# Altium schematic sheet nRF9161.SchDoc
size A3; ApprovedBy: Mustafa Atılay Beycan; CheckedBy: Mustafa Atılay Beycan; Author: Mustafa Atılay Beycan; CompanyName: Mustafa Atılay Beycan; DrawnBy: Mustafa Atılay Beycan; Engineer: Mustafa Atılay Beycan; Organization: Mustafa Atılay Beycan; SheetNumber: 3; SheetTotal: 8; FilePath: https://github.com/mustafaatilay/Outdoor-Tracking-Project
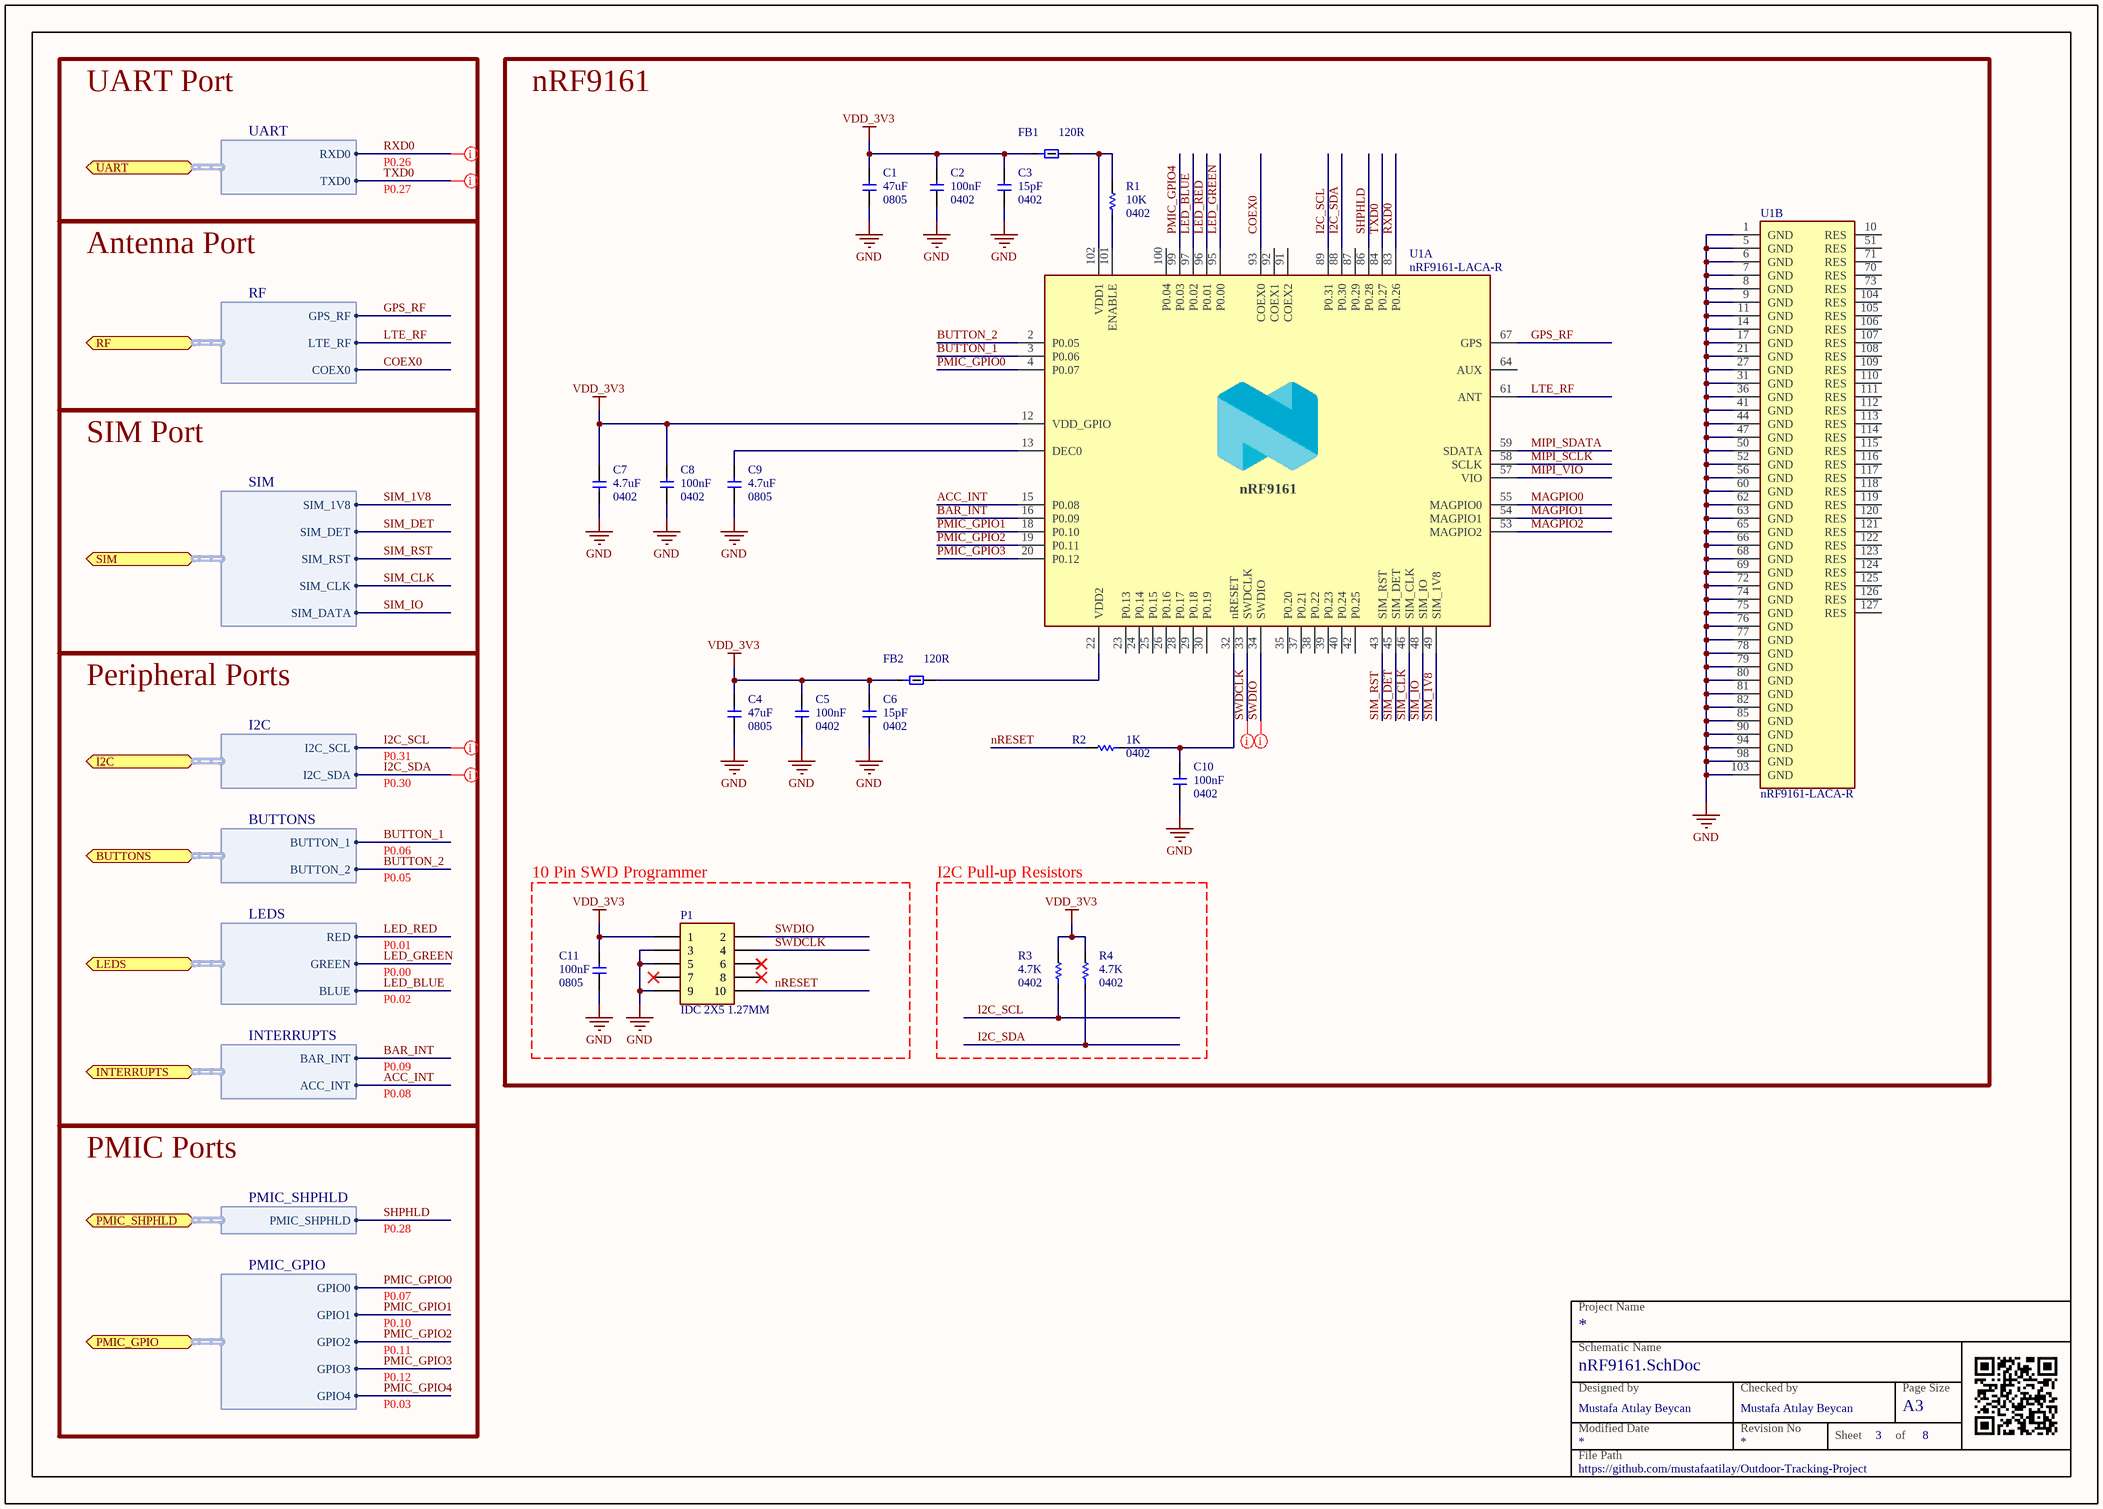
[diagram p0: nRF9161.SchDoc]

## Parts
C1  Capacitance: 47uF  Package: 0805  [CAP 0805]  (hidden comment: 47uF 10% X7R 10V 0805 SMD)
C2  Capacitance: 100nF  Package: 0402  [CAP 0402]  (hidden comment: 100nF 10% X7R 10V 0402 SMD)
C3  Capacitance: 15pF  Package: 0402  [CAP 0402]  (hidden comment: 15pF 10% X7R 16V 0402 SMD)
C4  Capacitance: 47uF  Package: 0805  [CAP 0805]  (hidden comment: 47uF 10% X7R 10V 0805 SMD)
C5  Capacitance: 100nF  Package: 0402  [CAP 0402]  (hidden comment: 100nF 10% X7R 10V 0402 SMD)
C6  Capacitance: 15pF  Package: 0402  [CAP 0402]  (hidden comment: 15pF 10% X7R 16V 0402 SMD)
C7  Capacitance: 4.7uF  Package: 0402  [CAP 0402]  (hidden comment: 4.7uF 10% X7R 10V 0402 SMD)
C8  Capacitance: 100nF  Package: 0402  [CAP 0402]  (hidden comment: 100nF 10% X7R 10V 0402 SMD)
C9  Capacitance: 4.7uF  Package: 0805  [CAP 0805]  (hidden comment: 4.7uF 10% X7R 10V 0805 SMD)
C10  Capacitance: 100nF  Package: 0402  [CAP 0402]  (hidden comment: 100nF 10% X7R 16V 0402 SMD)
C11  Capacitance: 100nF  Package: 0805  [CAP 0805]  (hidden comment: 100nF 10% X7R 16V 0805 SMD)
FB1  Impedance: 120R  [FERRITE 0402]  (hidden comment: BLM15AX121SN1D)
FB2  Impedance: 120R  [FERRITE 0402]  (hidden comment: BLM15AX121SN1D)
P1  IDC 2X5 1.27MM  [CONN 2x5 IDC 1.27MM]
R1  Resistance: 10K  Package: 0402  [RES 0402]  (hidden comment: 10K 1% 1/10W 0402 SMD)
R2  Resistance: 1K  Package: 0402  [RES 0402]  (hidden comment: 1K 5% 1/10W 0402 SMD)
R3  Resistance: 4.7K  Package: 0402  [RES 0402]  (hidden comment: 4.7K 5% 1/10W 0402 SMD)
R4  Resistance: 4.7K  Package: 0402  [RES 0402]  (hidden comment: 4.7K 5% 1/10W 0402 SMD)
U1  nRF9161-LACA-R  [IC nRF9161]  (parts A,B of 2)

## Blocks framed on the sheet
nRF9161: C1-C10 FB1 FB2 R1 R2 U1
10 Pin SWD Programmer: C11 P1
I2C Pull-up Resistors: R3 R4

## Ports
BUTTONS (bidir, harness BUTTONS), I2C (bidir, harness I2C), INTERRUPTS (bidir, harness INTERRUPTS), LEDS (bidir, harness LEDS), PMIC_GPIO (bidir, harness PMIC_GPIO), PMIC_SHPHLD (bidir, harness PMIC_SHPHLD), RF (bidir, harness RF), SIM (bidir, harness SIM), UART (bidir, harness UART)

## Harnesses
PMIC_GPIO: GPIO0, GPIO1, GPIO2, GPIO3, GPIO4
PMIC_SHPHLD: PMIC_SHPHLD
I2C: I2C_SCL, I2C_SDA
BUTTONS: BUTTON_1, BUTTON_2
LEDS: RED, GREEN, BLUE
INTERRUPTS: BAR_INT, ACC_INT
SIM: SIM_1V8, SIM_DET, SIM_RST, SIM_CLK, SIM_DATA
RF: GPS_RF, LTE_RF, COEX0
UART: RXD0, TXD0

## Nets
GND: C1.2 C2.2 C3.2 C4.2 C5.2 C6.2 C7.1 C8.2 C9.2 C10.2 C11.2 P1.3 P1.5 P1.9 U1.1(GND) U1.5(GND) U1.6(GND) U1.7(GND) U1.8(GND) U1.9(GND) U1.11(GND) U1.14(GND) U1.17(GND) U1.21(GND) U1.27(GND) U1.31(GND) U1.36(GND) U1.41(GND) U1.44(GND) U1.47(GND) U1.50(GND) U1.52(GND) U1.56(GND) U1.60(GND) U1.62(GND) U1.63(GND) U1.65(GND) U1.66(GND) U1.68(GND) U1.69(GND) U1.72(GND) U1.74(GND) U1.75(GND) U1.76(GND) U1.77(GND) U1.78(GND) U1.79(GND) U1.80(GND) U1.81(GND) U1.82(GND) U1.85(GND) U1.90(GND) U1.94(GND) U1.98(GND) U1.103(GND)
VDD_3V3: C1.1 C2.1 C3.1 C4.1 C5.1 C6.1 C7.2 C8.1 C11.1 FB1.1 FB2.1 P1.1 R3.2 R4.2 U1.12(VDD_GPIO)
ACC_INT: U1.15(P0.08) ; port INTERRUPTS.ACC_INT
BAR_INT: U1.16(P0.09) ; port INTERRUPTS.BAR_INT
BUTTON_1: U1.3(P0.06) ; port BUTTONS.BUTTON_1
BUTTON_2: U1.2(P0.05) ; port BUTTONS.BUTTON_2
COEX0: U1.93(COEX0) ; port RF.COEX0
GPS_RF: U1.67(GPS) ; port RF.GPS_RF
I2C_SCL: R3.1 U1.89(P0.31) ; port I2C.I2C_SCL
I2C_SDA: R4.1 U1.88(P0.30) ; port I2C.I2C_SDA
LED_BLUE: U1.97(P0.02) ; port LEDS.BLUE
LED_GREEN: U1.95(P0.00) ; port LEDS.GREEN
LED_RED: U1.96(P0.01) ; port LEDS.RED
LTE_RF: U1.61(ANT) ; port RF.LTE_RF
MAGPIO0: U1.55(MAGPIO0)
MAGPIO1: U1.54(MAGPIO1)
MAGPIO2: U1.53(MAGPIO2)
MIPI_SCLK: U1.58(SCLK)
MIPI_SDATA: U1.59(SDATA)
MIPI_VIO: U1.57(VIO)
nRESET: P1.10 R2.2
PMIC_GPIO0: U1.4(P0.07) ; port PMIC_GPIO.GPIO0
PMIC_GPIO1: U1.18(P0.10) ; port PMIC_GPIO.GPIO1
PMIC_GPIO2: U1.19(P0.11) ; port PMIC_GPIO.GPIO2
PMIC_GPIO3: U1.20(P0.12) ; port PMIC_GPIO.GPIO3
PMIC_GPIO4: U1.99(P0.03) ; port PMIC_GPIO.GPIO4
RXD0: U1.83(P0.26) ; port UART.RXD0
SHPHLD: U1.86(P0.28) ; port PMIC_SHPHLD.PMIC_SHPHLD
SIM_1V8: U1.49(SIM_1V8) ; port SIM.SIM_1V8
SIM_CLK: U1.46(SIM_CLK) ; port SIM.SIM_CLK
SIM_DET: U1.45(SIM_DET) ; port SIM.SIM_DET
SIM_IO: U1.48(SIM_IO) ; port SIM.SIM_DATA
SIM_RST: U1.43(SIM_RST) ; port SIM.SIM_RST
SWDCLK: P1.4 U1.33(SWDCLK)
SWDIO: P1.2 U1.34(SWDIO)
TXD0: U1.84(P0.27) ; port UART.TXD0
NetC9_1: C9.1 U1.13(DEC0)
NetC10_1: C10.1 R2.1 U1.32(nRESET)
NetFB1_2: FB1.2 R1.2 U1.102(VDD1)
NetFB2_2: FB2.2 U1.22(VDD2)
NetR1_1: R1.1 U1.101(ENABLE)

Not connected (* = marked no-connect by the designer): P1 6* 7* 8*; U1 10(RES) 23(P0.13) 24(P0.14) 25(P0.15) 26(P0.16) 28(P0.17) 29(P0.18) 30(P0.19) 35(P0.20) 37(P0.21) 38(P0.22) 39(P0.23) 40(P0.24) 42(P0.25) 51(RES) 64(AUX) 70(RES) 71(RES) 73(RES) 87(P0.29) 91(COEX2) 92(COEX1) 100(P0.04) 104(RES) 105(RES) 106(RES) 107(RES) 108(RES) 109(RES) 110(RES) 111(RES) 112(RES) 113(RES) 114(RES) 115(RES) 116(RES) 117(RES) 118(RES) 119(RES) 120(RES) 121(RES) 122(RES) 123(RES) 124(RES) 125(RES) 126(RES) 127(RES)

## Layout directives
net class SWD: SWDCLK, SWDIO
net class UART: RXD0, TXD0
net class I2C: I2C_SCL, I2C_SDA

## Notes on the sheet
- UART Port
- P0.26
- P0.27
- Antenna Port
- SIM Port
- Peripheral Ports
- P0.30
- P0.31
- P0.06
- P0.05
- P0.00
- P0.01
- P0.02
- P0.09
- P0.08
- PMIC Ports
- P0.28
- P0.07
- P0.10
- P0.03
- P0.11
- P0.12
- Project Name
- Designed by
- Schematic Name
- Checked by
- Page Size
- File Path
- Modified Date
- Revision No
- Sheet
- of
- A3
- (in symbol IC nRF9161-LACA-R, part A) nRF9161

## Library data of the parts
C1 C4 = CAP 0805 47uF 10V: ALT MALZEME KODU: 1.009.00956; Link: *; Manufacturer: *; Manufacturer Part Number: *; Value: 47uF 10% X7R 10V 0805 SMD; Tolerance: 10%; TemperatureCoefficient: X7R; Mount: SMD; Voltage: 10V
C2 C5 C8 = CAP 0402 100nF 10V: ALT MALZEME KODU: 1.009.00840; Link: *; Manufacturer: *; Manufacturer Part Number: *; Value: 100nF 10% X7R 10V 0402 SMD; Tolerance: 10%; TemperatureCoefficient: X7R; Mount: SMD; Voltage: 10V
C3 C6 = CAP 0402 15pF 16V: ALT MALZEME KODU: 1.009.00947; Link: *; Manufacturer: *; Manufacturer Part Number: *; Value: 15pF 10% X7R 16V 0402 SMD; Tolerance: 10%; TemperatureCoefficient: X7R; Mount: SMD; Voltage: 16V
C7 = CAP 0402 4.7uF 10V: ALT MALZEME KODU: 1.009.00987; Link: *; Manufacturer: *; Manufacturer Part Number: *; Value: 4.7uF 10% X7R 10V 0402 SMD; Tolerance: 10%; TemperatureCoefficient: X7R; Mount: SMD; Voltage: 10V
C9 = CAP 0805 4.7uF 10V: ALT MALZEME KODU: 1.009.00882; Link: *; Manufacturer: *; Manufacturer Part Number: *; Value: 4.7uF 10% X7R 10V 0805 SMD; Tolerance: 10%; TemperatureCoefficient: X7R; Mount: SMD; Voltage: 10V
C10 = CAP 0402 100nF 16V: ALT MALZEME KODU: 1.009.00275; Link: *; Manufacturer: *; Manufacturer Part Number: *; Value: 100nF 10% X7R 16V 0402 SMD; Tolerance: 10%; TemperatureCoefficient: X7R; Mount: SMD; Voltage: 16V
C11 = CAP 0805 100nF 16V: ALT MALZEME KODU: 1.009.00953; Link: *; Manufacturer: *; Manufacturer Part Number: *; Value: 100nF 10% X7R 16V 0805 SMD; Tolerance: 10%; TemperatureCoefficient: X7R; Mount: SMD; Voltage: 16V
FB1 FB2 = FER BLM15AX121SN1D: FERRITE BEAD 120 OHM 0402 1LN; Manufacturer: Murata; Material: Steel; Core Material: 228ConductorMaterial; Tolerance: 25%; Current Rating: 700mA; Number of Lines: 1; DC Resistance (DCR): 130mR; Test Frequency: 100MHz; ComponentLink1URL: https://datasheet.ciiva.com/18183/getdatasheetpartid-238207-18183177.pdf?src-supplier=Verical; ComponentLink1Description: https://datasheet.ciiva.com/18183/getdatasheetpartid-238207-18183177.pdf?src-supplier=Verical; ComponentLink2URL: https://datasheet.ciiva.com/41449/001172204-da-01-en-drossel-0402-600r-1-0x0-5mm-10000st-41449492.pdf?src-supplier=Conrad; ComponentLink2Description: https://datasheet.ciiva.com/41449/001172204-da-01-en-drossel-0402-600r-1-0x0-5mm-10000st-41449492.pdf?src-supplier=Conrad; ComponentLink3URL: https://datasheet.ciiva.com/41425/001171685-da-01-en-chip-drossel0402-600r-300ma-1-0x0-5mm-41425771.pdf?src-supplier=Conrad; ComponentLink3Description: https://datasheet.ciiva.com/41425/001171685-da-01-en-chip-drossel0402-600r-300ma-1-0x0-5mm-41425771.pdf?src-supplier=Conrad; ComponentLink4URL: https://datasheet.ciiva.com/1014/l0110s0101blm15h-1014466.pdf?src-supplier=Digi-Key; ComponentLink4Description: https://datasheet.ciiva.com/1014/l0110s0101blm15h-1014466.pdf?src-supplier=Digi-Key; ComponentLink5URL: https://datasheet.ciiva.com/1014/l0110s0101blm15h-1014467.pdf?src-supplier=Digi-Key; ComponentLink5Description: https://datasheet.ciiva.com/1014/l0110s0101blm15h-1014467.pdf?src-supplier=Digi-Key; ComponentLink6URL: https://datasheet.ciiva.com/1466/5168-1466917.pdf?src-supplier=Element14; ComponentLink6Description: https://datasheet.ciiva.com/1466/5168-1466917.pdf?src-supplier=Element14; ComponentLink7URL: https://datasheet.ciiva.com/1466/5168-1466918.pdf?src-supplier=Element14; ComponentLink7Description: https://datasheet.ciiva.com/1466/5168-1466918.pdf?src-supplier=Element14; ComponentLink8URL: https://datasheet.ciiva.com/3081/l0110s0101blm15h-3081608.pdf?src-supplier=Avnet; ComponentLink8Description: https://datasheet.ciiva.com/3081/l0110s0101blm15h-3081608.pdf?src-supplier=Avnet; ComponentLink9URL: https://datasheet.ciiva.com/6212/l0110s0101blm15h-6212328.pdf?src-supplier=Digi-Key; ComponentLink9Description: https://datasheet.ciiva.com/6212/l0110s0101blm15h-6212328.pdf?src-supplier=Digi-Key; ComponentLink10URL: https://datasheet.ciiva.com/16204/l0110s0101blm15h-16204027.pdf?src-supplier=Future+Electronics; ComponentLink10Description: https://datasheet.ciiva.com/16204/l0110s0101blm15h-16204027.pdf?src-supplier=Future+Electronics; Link: https://bit.ly/3wIr28H; ALT MALZEME KODU: *; Supplier 1: Mouser; Manufacturer Part Number: BLM15AX121SN1D; RoHS: Yes; Category: Ferrite Beads and Chips; Stock 1: 30042; Pricing 1: 1=0,1, 10=0,051, 50=0,051, 100=0,028, 1000=0,022, 10000=0,015 (USD); Case/Package: 0402; Number of Pins: 2; Case Code (Metric): 1005; Case Code (Imperial): 0402; Weight: 2.3E-05oz; Min Operating Temperature: -55°C; Max Operating Temperature: 125°C; Package Quantity: 1; Packaging: Tape and Reel; Max Current Rating: 700mA; Termination: SMD/SMT; Max DC Current: 700mA; Number of Circuits: 1; Series: BLM15AX_SN; RMS Current (Irms): 700mA; Series Resistance: 130mR; Length: 1mm; Width: 0.5mm; Height: 0.5mm; Reach SVHC Compliant: No; Lead Free: Lead Free; RoHS Compliant: Yes; ComponentLink11URL: https://datasheet.ciiva.com/41449/001172167-da-01-en-drossel-0402-120r-1-0x0-5mm-10000st-41449456.pdf?src-supplier=Conrad; ComponentLink11Description: https://datasheet.ciiva.com/41449/001172167-da-01-en-drossel-0402-120r-1-0x0-5mm-10000st-41449456.pdf?src-supplier=Conrad; ComponentLink12URL: https://datasheet.ciiva.com/1012/l0110e-1012387.pdf?src-supplier=Digikey; ComponentLink12Description: https://datasheet.ciiva.com/1012/l0110e-1012387.pdf?src-supplier=Digikey; ComponentLink13URL: https://datasheet.ciiva.com/1012/l0110e-1012386.pdf?src-supplier=Digikey; ComponentLink13Description: https://datasheet.ciiva.com/1012/l0110e-1012386.pdf?src-supplier=Digikey; ComponentLink14URL: https://datasheet.ciiva.com/1012/l0110e-1012388.pdf?src-supplier=Digikey; ComponentLink14Description: https://datasheet.ciiva.com/1012/l0110e-1012388.pdf?src-supplier=Digikey; Supplier Part Number 1: 81-BLM15AX121SN1D
P1 = HEADER 2 X 5 IDC: CONN HEADER 2 X 5 1.27MM; LatestRevisionDate: 17-Jul-2002; LatestRevisionNote: Re-released for DXP Platform.; Publisher: Altium Limited
R1 = RES 0402 10K 1%: ALT MALZEME KODU: 1.031.00963; Link: *; Manufacturer: *; Manufacturer Part Number: *; Value: 10K 1% 1/10W 0402 SMD; Tolerance: 1%; PowerRating: 1/10W; Mount: SMD
R2 = RES 0402 1K 5%: ALT MALZEME KODU: 1.031.00622; Link: *; Manufacturer: *; Manufacturer Part Number: *; Value: 1K 5% 1/10W 0402 SMD; PowerRating: 1/10W; Mount: SMD; Tolerance: 5%
R3 R4 = RES 0402 4.7K 5%: ALT MALZEME KODU: 1.031.00627; Link: *; Manufacturer: *; Manufacturer Part Number: *; Value: 4.7K 5% 1/10W 0402 SMD; PowerRating: 1/10W; Mount: SMD; Tolerance: 5%
U1 = IC nRF9161-LACA-R: Manufacturer: Nordic Semiconductor ASA; Voltage - Supply: 3V ~ 5.5V; GPIO: 32; Serial Interfaces: I2C, I2S, PWM, SPI, UART; Memory Size: 1MB Flash, 256kB RAM; Sensitivity: -108dBm; Power - Output: 23dBm; Data Rate (Max): 8Mbps; Frequency: 600MHz ~ 2.2GHz; Protocol: GPS; RF Family/Standard: Cellular; Link 2: https://bit.ly/4aFKUH8; Link: https://bit.ly/3X10dqO; Type: TxRx Only; Manufacturer Product Number: NRF9161-LACA-R; Series: NRF9161